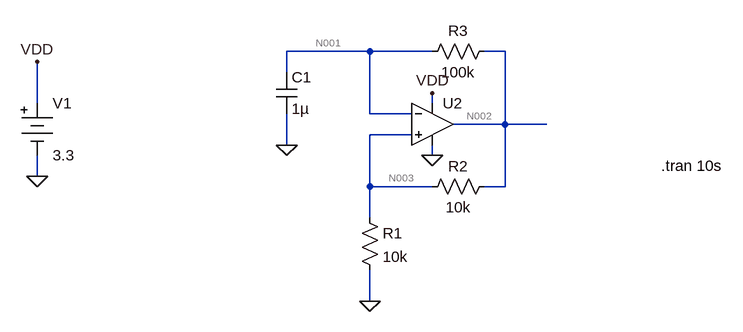
[diagram p0: schematic relaxation_osc.asc]
relaxation_osc.asc, the LTspice schematic file:
Version 4
SHEET 1 880 680
WIRE -272 -192 -400 -192
WIRE -176 -192 -272 -192
WIRE -64 -192 -96 -192
WIRE -400 -160 -400 -192
WIRE -784 -112 -784 -176
WIRE -176 -112 -176 -128
WIRE -272 -96 -272 -192
WIRE -208 -96 -272 -96
WIRE -64 -80 -64 -192
WIRE -64 -80 -144 -80
WIRE 0 -80 -64 -80
WIRE -208 -64 -272 -64
WIRE -400 -48 -400 -96
WIRE -176 -32 -176 -48
WIRE -784 0 -784 -32
WIRE -272 16 -272 -64
WIRE -176 16 -272 16
WIRE -64 16 -64 -80
WIRE -64 16 -96 16
WIRE -272 64 -272 16
WIRE -272 192 -272 144
FLAG -400 -48 0
FLAG -272 192 0
FLAG -176 -32 0
FLAG -176 -128 VDD
FLAG -784 0 0
FLAG -784 -176 VDD
SYMBOL res -288 48 R0
SYMATTR InstName R1
SYMATTR Value 10k
SYMBOL res -80 0 R90
WINDOW 0 0 56 VBottom 2
WINDOW 3 32 56 VTop 2
SYMATTR InstName R2
SYMATTR Value 10k
SYMBOL res -80 -208 R90
WINDOW 0 0 56 VBottom 2
WINDOW 3 32 56 VTop 2
SYMATTR InstName R3
SYMATTR Value 100k
SYMBOL cap -416 -160 R0
SYMATTR InstName C1
SYMATTR Value 1µ
SYMBOL Opamps\\UniversalOpamp2 -176 -80 R0
SYMATTR InstName U2
SYMBOL Misc\\battery -784 -128 R0
WINDOW 123 0 0 Left 0
WINDOW 39 0 0 Left 0
SYMATTR InstName V1
SYMATTR Value 3.3
TEXT 176 -16 Left 2 !.tran 10s

The netlist it stands for:
* relaxation_osc.asc
R1 N003 0 10k
R2 N002 N003 10k
R3 N002 N001 100k
C1 N001 0 1µ
XU2 N003 N001 VDD 0 N002 level.2 Avol=1Meg GBW=10Meg Slew=10Meg ilimit=25m rail=0 Vos=0 phimargin=45 en=0 enk=0 in=0 ink=0 Rin=500Meg  ; pins IN+ IN- V+ V- OUT
V1 VDD 0 3.3
.tran 10s
.lib UniversalOpamps2.sub
.backanno
.end

* Results of the author's LTspice run, read from the files saved beside the schematic
* Operating Point, zero values left out:
*   V(n003) = 2.451 mV
*   V(n002) = 4.869 mV
*   V(n001) = 5.198 mV
*   V(vdd) = 3.3 V
*   I(R3) = -3.29 nA
*   I(R2) = 241.8 nA
*   I(R1) = 245.1 nA
*   I(V1) = -12.81 µA
*   Ix(u2:1) = -3.295 nA
*   Ix(u2:2) = -3.29 nA
*   Ix(u2:3) = 12.81 µA
*   Ix(u2:4) = -12.55 µA
*   Ix(u2:5) = -238.5 nA
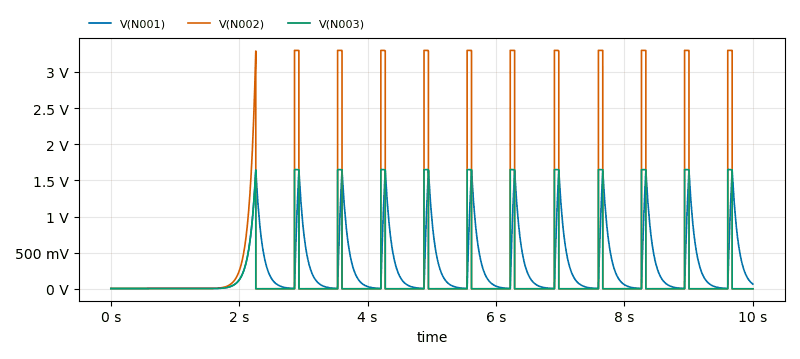
[diagram p1: Transient Analysis of relaxation_osc.asc, plotted from the saved traces]
* Transient Analysis, 1 run:
*   V(N001): min 4.508 mV, max 1.638 V, average 282.3 mV, rms 507.9 mV, last 64.92 mV
*   V(N002): min 12.46 µV, max 3.298 V, average 281.8 mV, rms 934.1 mV, last 13.19 µV
*   V(N003): min 22.73 µV, max 1.649 V, average 140.9 mV, rms 467 mV, last 23.09 µV